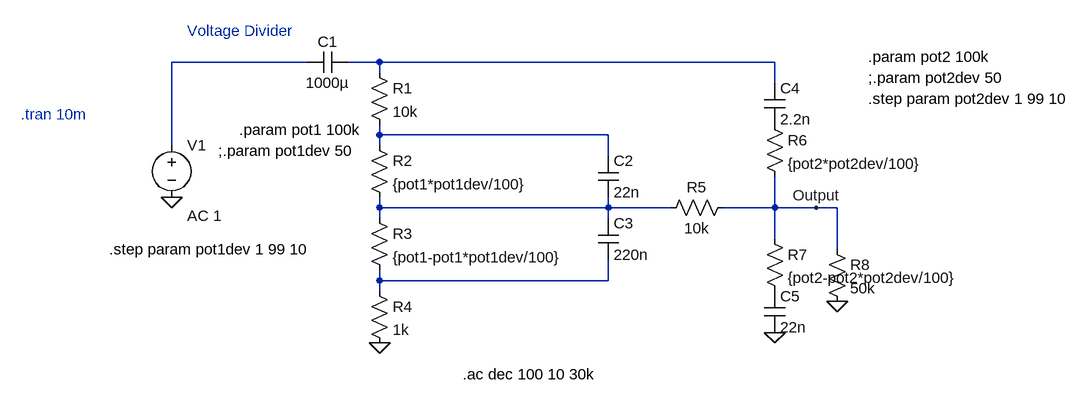
[diagram p0: schematic Baxandall_Example.asc]
Baxandall_Example.asc, the LTspice schematic file:
Version 4
SHEET 1 1440 680
WIRE 240 32 32 32
WIRE 352 32 304 32
WIRE 960 32 352 32
WIRE 352 48 352 32
WIRE 960 64 960 32
WIRE 352 144 352 128
WIRE 704 144 352 144
WIRE 32 160 32 32
WIRE 352 160 352 144
WIRE 704 176 704 144
WIRE 352 256 352 240
WIRE 704 256 704 240
WIRE 704 256 352 256
WIRE 800 256 704 256
WIRE 960 256 960 208
WIRE 960 256 880 256
WIRE 1024 256 960 256
WIRE 1056 256 1024 256
WIRE 352 272 352 256
WIRE 704 272 704 256
WIRE 960 304 960 256
WIRE 1056 320 1056 256
WIRE 352 368 352 352
WIRE 704 368 704 336
WIRE 704 368 352 368
WIRE 352 384 352 368
FLAG 32 240 0
FLAG 1024 256 Output
FLAG 352 464 0
FLAG 960 448 0
FLAG 1056 400 0
SYMBOL voltage 32 144 R0
WINDOW 123 24 124 Left 2
WINDOW 39 0 0 Left 0
SYMATTR InstName V1
SYMATTR Value ""
SYMATTR Value2 AC 1
SYMBOL cap 304 16 R90
WINDOW 0 0 32 VBottom 2
WINDOW 3 32 32 VTop 2
SYMATTR InstName C1
SYMATTR Value 1000µ
SYMBOL res 336 32 R0
SYMATTR InstName R1
SYMATTR Value 10k
SYMBOL res 336 144 R0
SYMATTR InstName R2
SYMATTR Value {pot1*pot1dev/100}
SYMBOL res 336 256 R0
SYMATTR InstName R3
SYMATTR Value {pot1-pot1*pot1dev/100}
SYMBOL res 336 368 R0
SYMATTR InstName R4
SYMATTR Value 1k
SYMBOL cap 688 176 R0
SYMATTR InstName C2
SYMATTR Value 22n
SYMBOL cap 688 272 R0
SYMATTR InstName C3
SYMATTR Value 220n
SYMBOL res 896 240 R90
WINDOW 0 0 56 VBottom 2
WINDOW 3 32 56 VTop 2
SYMATTR InstName R5
SYMATTR Value 10k
SYMBOL res 944 112 R0
SYMATTR InstName R6
SYMATTR Value {pot2*pot2dev/100}
SYMBOL res 944 288 R0
SYMATTR InstName R7
SYMATTR Value {pot2-pot2*pot2dev/100}
SYMBOL cap 944 64 R0
SYMATTR InstName C4
SYMATTR Value 2.2n
SYMBOL cap 944 384 R0
SYMATTR InstName C5
SYMATTR Value 22n
SYMBOL res 1040 304 R0
SYMATTR InstName R8
SYMATTR Value 50k
TEXT 56 -16 Left 2 ;Voltage Divider
TEXT -200 112 Left 2 ;.tran 10m
TEXT 136 136 Left 2 !.param pot1 100k
TEXT 104 168 Left 2 !;.param pot1dev 50
TEXT 1104 56 Left 2 !;.param pot2dev 50
TEXT 1104 24 Left 2 !.param pot2 100k
TEXT 480 512 Left 2 !.ac dec 100 10 30k
TEXT 1104 88 Left 2 !.step param pot2dev 1 99 10
TEXT -64 320 Left 2 !.step param pot1dev 1 99 10

The netlist it stands for:
* Baxandall_Example.asc
V1 N001 0 AC 1
C1 N002 N001 1000µ
R1 N002 N003 10k
R2 N003 N004 {pot1*pot1dev/100}
R3 N004 N005 {pot1-pot1*pot1dev/100}
R4 N005 0 1k
C2 N003 N004 22n
C3 N004 N005 220n
R5 Output N004 10k
R6 P001 Output {pot2*pot2dev/100}
R7 Output P002 {pot2-pot2*pot2dev/100}
C4 N002 P001 2.2n
C5 P002 0 22n
R8 Output 0 50k
* Voltage Divider
* .tran 10m
.param pot1 100k
;.param pot1dev 50
;.param pot2dev 50
.param pot2 100k
.ac dec 100 10 30k
.step param pot2dev 1 99 10
.step param pot1dev 1 99 10
.backanno
.end